# Altium project PCB_Project.PrjPcb
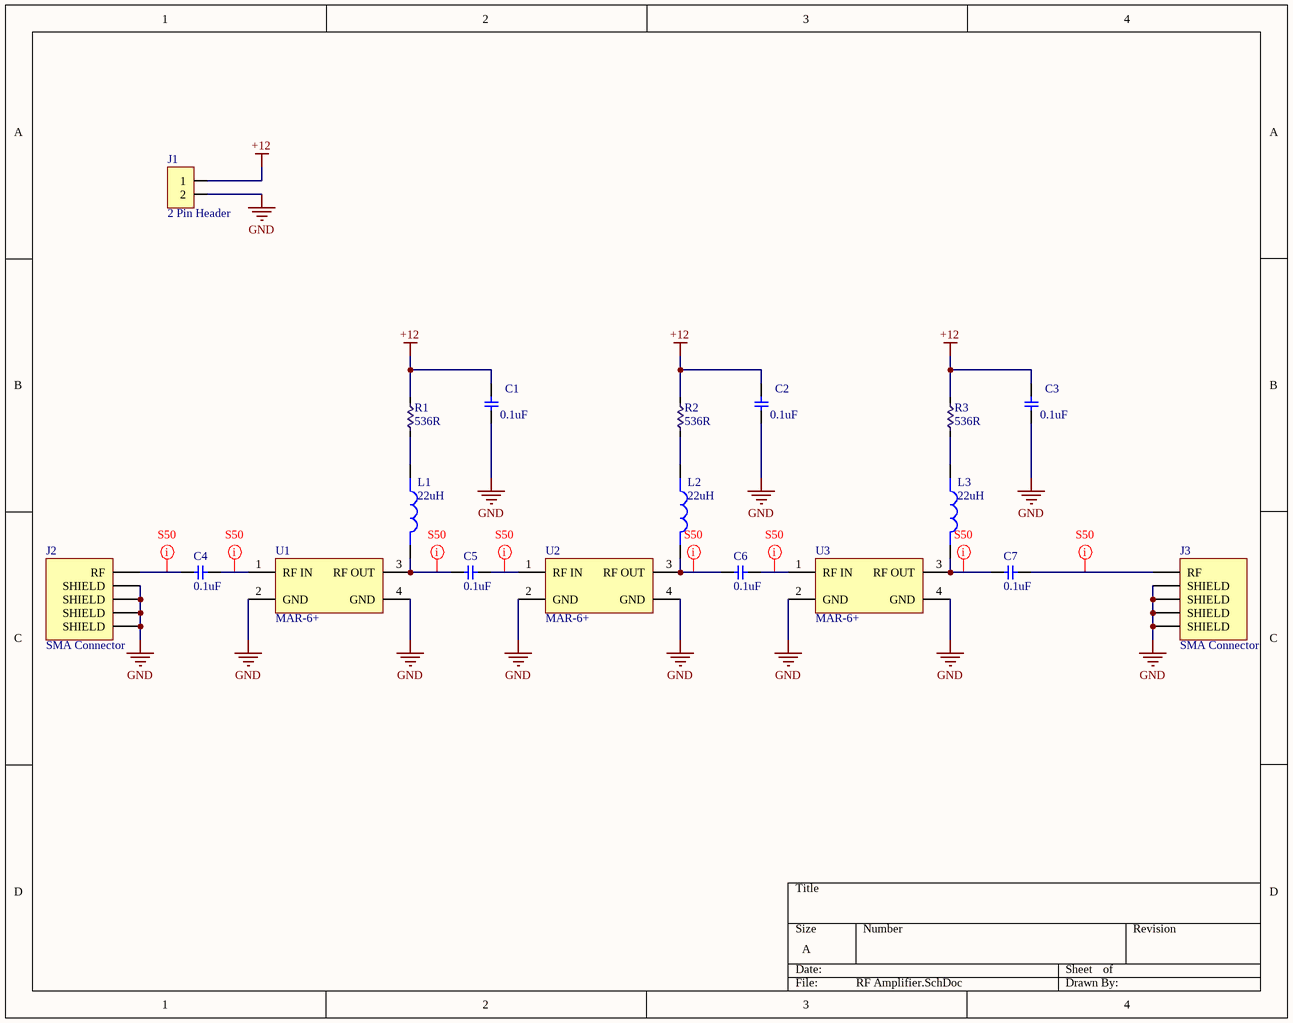
[diagram p0: RF Amplifier.SchDoc]
1 sheet, 19 parts. Net scope: global (net labels, ports and power ports of the same name join across sheets).
Board file: RF Amplifier.PcbDoc

## Sheet RF Amplifier.SchDoc
size A

### Parts
C1  0.1uF  [CAP805]
C2  0.1uF  [CAP805]
C3  0.1uF  [CAP805]
C4  0.1uF  [CAP805]
C5  0.1uF  [CAP805]
C6  0.1uF  [CAP805]
C7  0.1uF  [CAP805]
J1  2 Pin Header  [Connector_2POS_2.54mm]
J2  SMA Connector  [Molex 73251-1150]
J3  SMA Connector  [Molex 73251-1150]
L1  22uH  [INDUCtOR_SMD_4.2x4.4]
L2  22uH  [INDUCtOR_SMD_4.2x4.4]
L3  22uH  [INDUCtOR_SMD_4.2x4.4]
R1  536R  [RES1812]
R2  536R  [RES1812]
R3  536R  [RES1812]
U1  MAR-6+  [VV105]
U2  MAR-6+  [VV105]
U3  MAR-6+  [VV105]

### Nets
+12: C1.2 C2.2 C3.2 J1.1 R1.2 R2.2 R3.2
GND: C1.1 C2.1 C3.1 J1.2 J2.2(SHIELD) J2.3(SHIELD) J2.4(SHIELD) J2.5(SHIELD) J3.2(SHIELD) J3.3(SHIELD) J3.4(SHIELD) J3.5(SHIELD) U1.2(GND) U1.4(GND) U2.2(GND) U2.4(GND) U3.2(GND) U3.4(GND)
NetC4_1: C4.1 J2.1(RF)
NetC4_2: C4.2 U1.1(RF_IN)
NetC5_1: C5.1 L1.2 U1.3(RF_OUT)
NetC5_2: C5.2 U2.1(RF_IN)
NetC6_1: C6.1 L2.2 U2.3(RF_OUT)
NetC6_2: C6.2 U3.1(RF_IN)
NetC7_1: C7.1 L3.2 U3.3(RF_OUT)
NetC7_2: C7.2 J3.1(RF)
NetL1_1: L1.1 R1.1
NetL2_1: L2.1 R2.1
NetL3_1: L3.1 R3.1

### Layout directives
net class S50: NetC4_1, NetC4_2, NetC5_1, NetC5_2, NetC6_1, NetC6_2, NetC7_1, NetC7_2

### Library data of the parts
C1-C7 = Cap
L1-L3 = Inductor
R1-R3 = Res